# Altium schematic sheet FRONT_PANEL.SchDoc
size A4; SheetNumber: 4; SheetTotal: 5
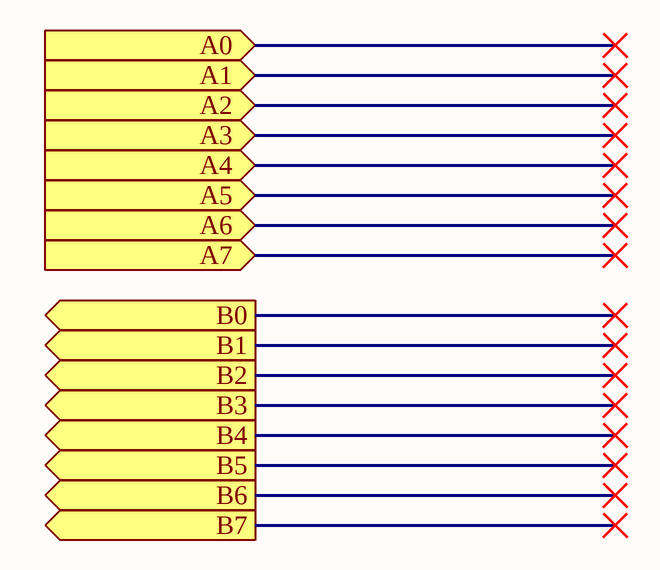
[diagram p0: FRONT_PANEL.SchDoc]

## Ports
A0 (in, see MED_BOX[2B], I2C_HANDLER[2A]), A1 (in, see MED_BOX[2B], I2C_HANDLER[2A]), A2 (in, see MED_BOX[2B], I2C_HANDLER[2A]), A3 (in, see MED_BOX[2B], I2C_HANDLER[2A]), A4 (in, see MED_BOX[2B], I2C_HANDLER[2A]), A5 (in, see MED_BOX[2B], I2C_HANDLER[2A]), A6 (in, see MED_BOX[2B], I2C_HANDLER[2A]), A7 (in, see MED_BOX[2B], I2C_HANDLER[2A]), B0 (out, see MED_BOX[2B], I2C_HANDLER[2B]), B1 (out, see MED_BOX[2B], I2C_HANDLER[2B]), B2 (out, see MED_BOX[2B], I2C_HANDLER[2B]), B3 (out, see MED_BOX[2B], I2C_HANDLER[2B]), B4 (out, see MED_BOX[2B], I2C_HANDLER[2B]), B5 (out, see MED_BOX[2C], I2C_HANDLER[2B]), B6 (out, see MED_BOX[2C], I2C_HANDLER[2B]), B7 (out, see MED_BOX[2C], I2C_HANDLER[2B])